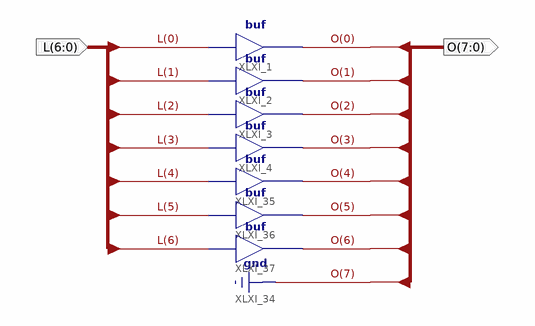
[diagram p0: schematic sheet 1]
// Xilinx ISE schematic resize7x8x0l.sch (spartan6) as structural Verilog: 7 symbols, 2 ports
module resize7x8x0l (
  input  [6:0] L,
  output [7:0] O
);

  buf XLXI_1 (O[0], L[0]);
  buf XLXI_2 (O[1], L[1]);
  buf XLXI_3 (O[2], L[2]);
  buf XLXI_4 (O[3], L[3]);
  buf XLXI_35 (O[4], L[4]);
  buf XLXI_36 (O[5], L[5]);
  buf XLXI_37 (O[6], L[6]);

  assign O[7] = 1'b0;
endmodule
